# EAGLE design Group 10 Plant Sensor (EAGLE 9.2.0)
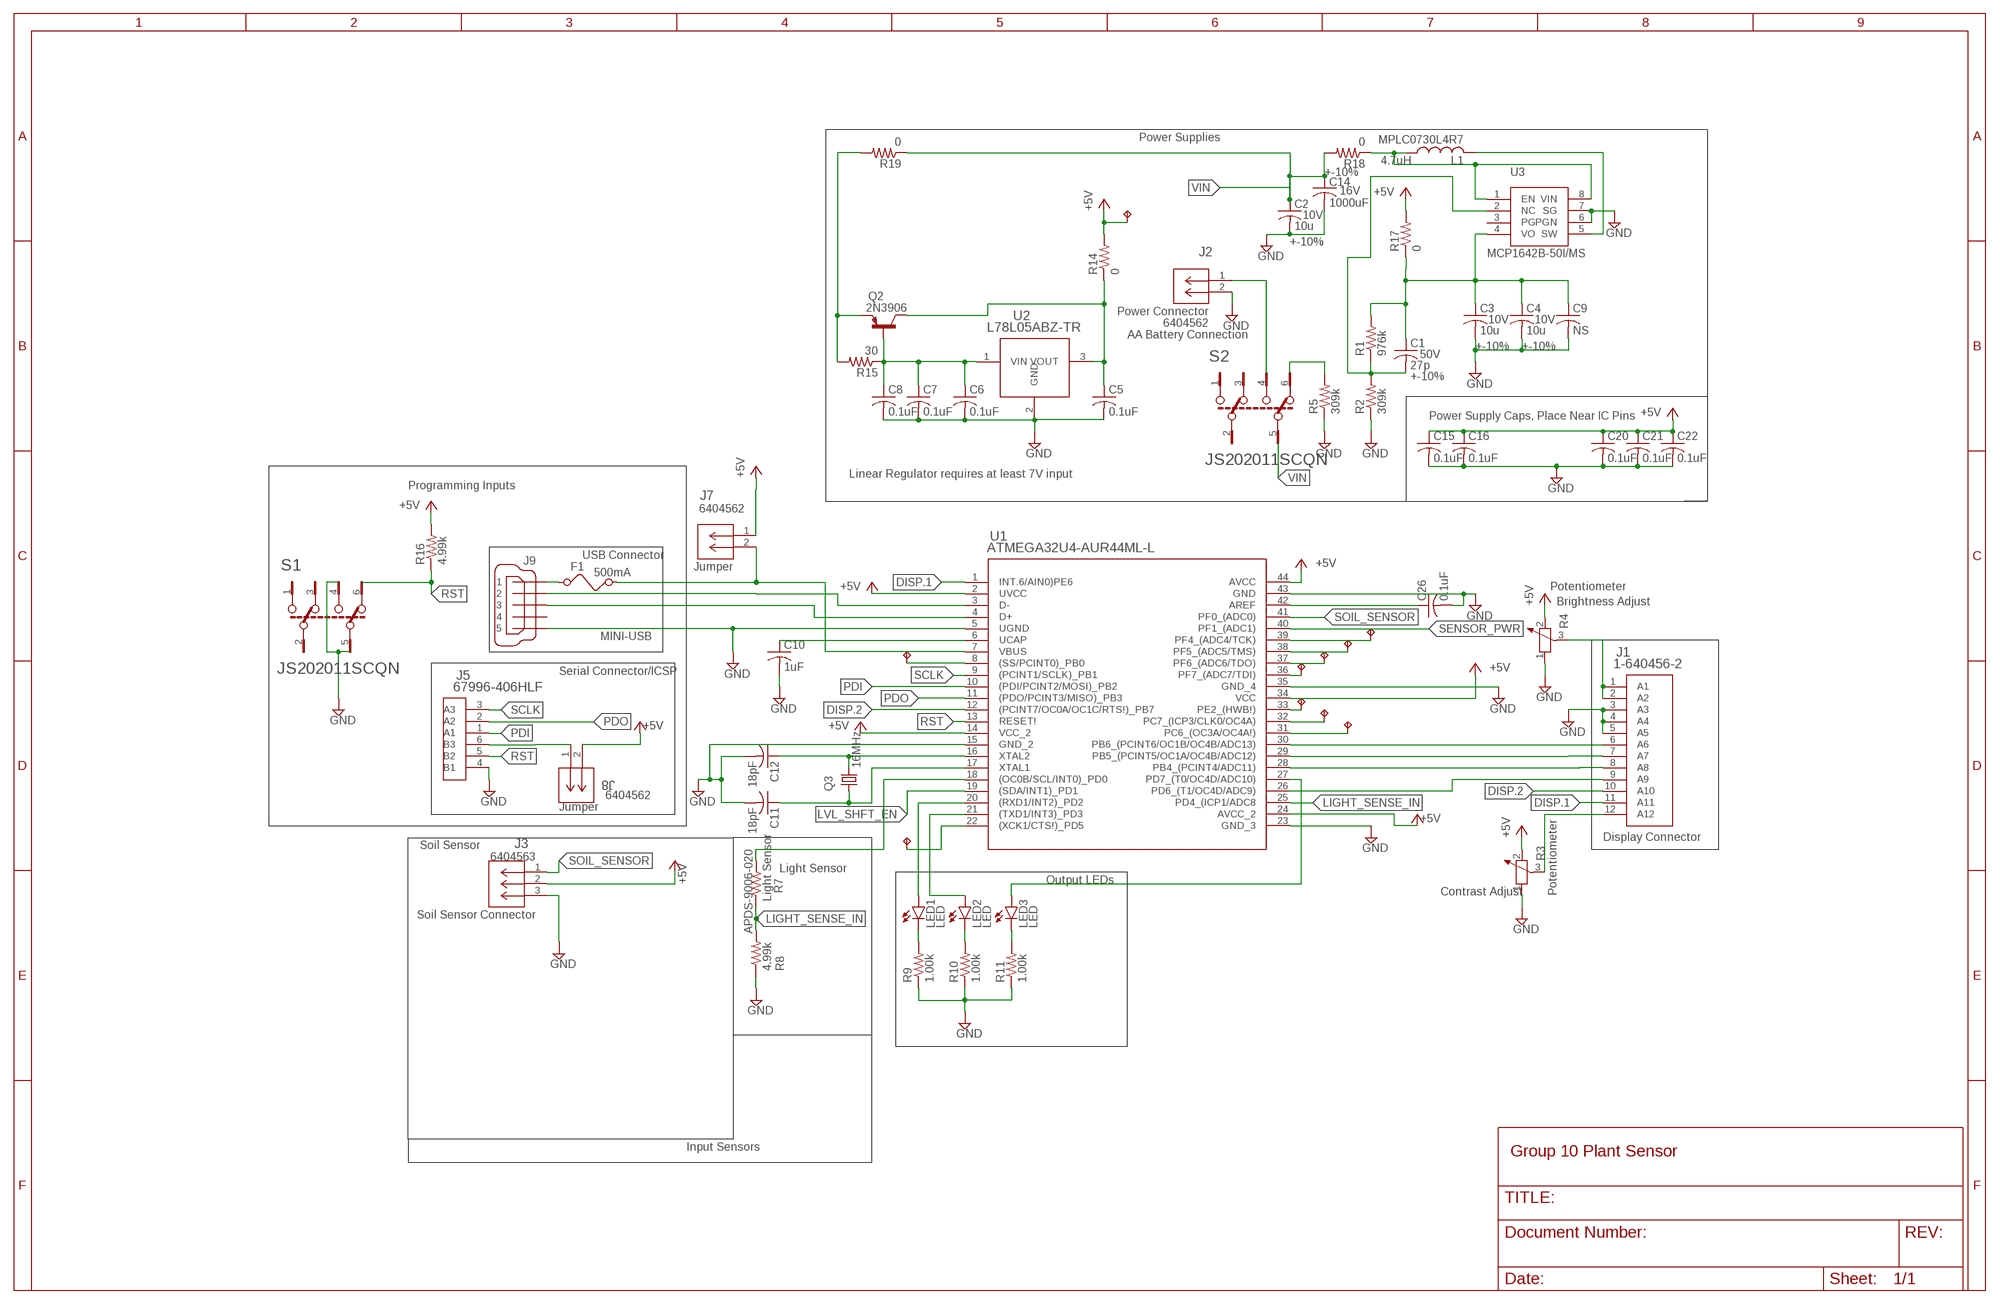
[diagram p0: schematic, sheet 1]

## Parts
C1  27p  C-USC0805K  [C0805K]
C2  10u  C-USC0805K  [C0805K]
C3  10u  C-USC0805K  [C0805K]
C4  10u  C-USC0805K  [C0805K]
C5  0.1uF  C-USC0805  [C0805]
C6  0.1uF  C-USC0805  [C0805]
C7  0.1uF  C-USC0805  [C0805]
C8  0.1uF  C-USC0805  [C0805]
C9  NS  C-USC0603K  [C0603K]
C10  1uF  C-USC0805K  [C0805K]
C11  18pF  C-USC0805K  [C0805K]
C12  18pF  C-USC0805K  [C0805K]
C14  1000uF  C-US050-050X075  [C050-050X075]
C15  0.1uF  C-USC0805  [C0805]
C16  0.1uF  C-USC0805  [C0805]
C20  0.1uF  C-USC0805  [C0805]
C21  0.1uF  C-USC0805  [C0805]
C22  0.1uF  C-USC0805  [C0805]
C26  0.1uF  C-USC0805  [C0805]
F1  500mA  FUSEFUSE1206  [R1206]
J1  1-640456-2  [1-640456-2]
J2  640456-2  [CONN2_640456-2]
J3  640456-3  [CONN3_640456-3]
J5  67996-406HLF  [67996-406HLF]
J7  640456-2  [CONN2_640456-2]
J8  640456-2  [CONN2_640456-2]
J9  MINI-USB  MINI-USB-32005-201  [32005-201]
L1  MPLC0730L4R7  [MPLC0730L4R7]
LED1  LED  LED3MM  [LED3MM]
LED2  LED  LED3MM  [LED3MM]
LED3  LED  LED3MM  [LED3MM]
Q2  2N3906  [TO92]
Q3  16MHz  CRYSTALHC18U-V  [HC18U-V]
R1  976k  R-US_R0805  [R0805]
R2  309k  R-US_R0805  [R0805]
R3  Potentiometer  POTENTIOMETER_PT-10S  [PT-10S]
R4  Potentiometer  POTENTIOMETER_PT-10S  [PT-10S]
R5  309k  R-US_R0805  [R0805]
R7  Light Sensor  R-US_R1206W  [R1206W]
R8  4.99k  R-US_R1206W  [R1206W]
R9  1.00k  R-US_R0805  [R0805]
R10  1.00k  R-US_R0805  [R0805]
R11  1.00k  R-US_R0805  [R0805]
R14  0  R-US_R0603  [R0603]
R15  30  R-US_R0805  [R0805]
R16  4.99k  R-US_R1206W  [R1206W]
R17  0  R-US_R0603  [R0603]
R18  0  R-US_R0603  [R0603]
R19  0  R-US_R0603  [R0603]
S1  SWITCH2  [C&K_JS202011CQN_0]
S2  SWITCH2  [C&K_JS202011CQN_0]
U1  ATMEGA32U4-AUR44ML-L  [44ML-L]
U2  L78L05ABZ-TR  [TO-92-TR]
U3  MCP1642B/D8-MSOP  [MSOP8]
U$3  TESTPIN  [1-640456-0(2)]
U$4  TESTPIN  [1-640456-0(2)]
U$5  TESTPIN  [1-640456-0(2)]
U$6  TESTPIN  [1-640456-0(2)]
U$7  TESTPIN  [1-640456-0(2)]
U$8  TESTPIN  [1-640456-0(2)]
U$9  TESTPIN  [1-640456-0(2)]
U$10  TESTPIN  [1-640456-0(2)]
U$11  TESTPIN  [1-640456-0(2)]
U$12  TESTPIN  [1-640456-0(2)]

## Nets
AREF: C26.1 U1.42(AREF)
DISP.1: J1.11(A11) U1.1(INT.6/AIN0)PE6)
DISP.2: J1.10(A10) U1.12((PCINT7/OC0A/OC1C/RTS!)_PB7)
DISP_5: J1.8(A8) U1.28(PB4_(PCINT4/ADC11))
GND: C2.2 C3.2 C4.2 C5.2 C6.2 C7.2 C8.2 C9.2 C10.2 C11.2 C12.2 C14.2 C15.2 C16.2 C20.2 C21.2 C22.2 C26.2 J1.3(A3) J1.4(A4) J1.5(A5) J2.2 J3.3 J5.4(B1) J9.5 R2.1 R3.1 R4.1 R5.1 R8.1 R9.1 R10.1 R11.1 S1.4 S1.5 U1.5(UGND) U1.15(GND_2) U1.23(GND_3) U1.35(GND_4) U1.43(GND) U2.2(GND) U3.6(PGN) U3.7(SG)
LIGHT_SENSE_IN: R7.1 R8.2 U1.25(PD4_(ICP1/ADC8)
LIGHT_SENSE_PWR: R7.2 U1.18((OC0B/SCL/INT0)_PD0)
LVL_SHFT_EN: U1.19((SDA/INT1)_PD1)
N$1: J1.12(A12) R3.3
N$2: L1.2 U3.5(SW)
N$3: J1.9(A9) U1.26(PD6_(T1/OC4D/ADC9))
N$5: C12.1 Q3.2 U1.16(XTAL2)
N$6: J1.6(A6) U1.30(PB6_(PCINT6/OC1B/OC4B/ADC13))
N$7: J1.7(A7) U1.29(PB5_(PCINT5/OC1A/OC4B/ADC12))
N$8: C11.1 Q3.1 U1.17(XTAL1)
N$9: J9.2 U1.3(D-)
N$10: J9.3 U1.4(D+)
N$11: F1.1 J9.1
N$12: LED3.K(C) R11.2
N$13: C1.1 C3.1 C4.1 C9.1 R1.2 R17.1 U3.4(VO)
N$14: J1.1(A1) J1.2(A2) R4.3
N$15: C6.1 C7.1 C8.1 Q2.2(B) R15.1 U2.1(VIN)
N$16: C10.1 U1.6(UCAP)
N$17: C5.1 Q2.1(C) R14.1 U2.3(VOUT)
N$18: LED2.K(C) R10.2
N$19: J5.6(B3) J8.1
N$20: LED1.K(C) R9.2
N$21: U1.8((SS/PCINT0)_PB0) U$12.1(TP)
N$22: R5.2 S2.6
N$23: LED1.A U1.20((RXD1/INT2)_PD2)
N$24: LED2.A U1.21((TXD1/INT3)_PD3)
N$25: LED3.A U1.27(PD7_(T0/OC4D/ADC10))
N$26: U1.31(PC6_(OC3A/OC4A!)) U$10.1(TP)
N$27: Q2.3(E) R15.2 R19.2
N$28: U1.32(PC7_(ICP3/CLK0/OC4A)) U$9.1(TP)
N$29: J2.1 S2.4
N$30: U1.33(PE2_(HWB!)) U$8.1(TP)
N$31: U1.36(PF7_(ADC7/TDI)) U$7.1(TP)
N$32: U1.37(PF6_(ADC6/TDO)) U$6.1(TP)
N$33: U1.22((XCK1/CTS!)_PD5) U$11.1(TP)
N$34: U1.38(PF5_(ADC5/TMS)) U$5.1(TP)
N$35: U1.39(PF4_(ADC4/TCK)) U$4.1(TP)
PDI: J5.1(A1) U1.10((PDI/PCINT2/MOSI)_PB2)
PDO: J5.2(A2) U1.11((PDO/PCINT3/MISO)_PB3)
RST: J5.5(B2) R16.1 S1.6 U1.13(RESET!)
SCLK: J5.3(A3) U1.9((PCINT1/SCLK)_PB1)
SENSOR_PWR: U1.40(PF1_(ADC1))
SOIL_SENSOR: J3.1 U1.41(PF0_(ADC0))
SWITCH: L1.1 R18.1 U3.1(EN) U3.8(VIN)
VBUS: F1.2 J7.2 U1.7(VBUS)
VCC: C15.1 C16.1 C20.1 C21.1 C22.1 J3.2 J7.1 J8.2 R3.2 R4.2 R14.2 R16.2 R17.2 U1.2(UVCC) U1.14(VCC_2) U1.24(AVCC_2) U1.34(VCC) U1.44(AVCC) U$3.1(TP) ; supply symbol labelled +5V
VFB: C1.2 R1.1 R2.2 U3.2(NC)
VIN: C2.1 C14.1 R18.2 R19.1 S2.5
Unconnected: J9.4 S1.1 S1.2 S1.3 S2.1 S2.2 S2.3 U3.3(PG)

## Notes on the sheet
- Power Supplies
- AA Battery Connection
- Power Supply Caps, Place Near IC Pins
- Linear Regulator requires at least 7V input
- Programming Inputs
- USB Connector
- Brightness Adjust
- Serial Connector/ICSP
- Display Connector
- Soil Sensor
- Light Sensor
- Output LEDs
- Contrast Adjust
- Input Sensors

## Library data of the parts
C1 = rcl:C-US: CAPACITOR, American symbol; COST: 0.16; DESCRIPTION: Ceramic FB Cap; DISTRIBUTER: Arrow; DIST_PART_NUMBER: C0805C270J1GACTU; MANUFACTURER: KEMET; MFG_PART_NUMBER: C0805C270J1GACTU; PACKAGE: 0805; PART_NUMBER: C0805C270J1GACTU; SPICEPREFIX: C; TOL: +-10%; VOLTAGE: 50V
C2-C4 = rcl:C-US: CAPACITOR, American symbol; COST: 0.27; DESCRIPTION: Ceramic Output Capacitor; DISTRIBUTER: Arrow; DIST_PART_NUMBER: GRM21BR61D106ME15L; MANUFACTURER: Murata; MFG_PART_NUMBER: GRM21BR61D106ME15L; PACKAGE: 0805; PART_NUMBER: GRM21BR61D106ME15L; SPICEPREFIX: C; TOL: +-10%; VOLTAGE: 10V
C5-C8 C15 C16 C20-C22 C26 = rcl:C-US: CAPACITOR, American symbol; COST: 0.35; DESCRIPTION: Power Supply Caps; DISTRIBUTER: Arrow; DIST_PART_NUMBER: C0805C104K6RACTU; MANUFACTURER: KEMET; MFG_PART_NUMBER: C0805C104K6RACTU; PACKAGE: 0805; PART_NUMBER: C0805C104K6RACTU; SPICEPREFIX: C
C9 = rcl:C-US: CAPACITOR, American symbol; SPICEPREFIX: C
C10 = rcl:C-US: CAPACITOR, American symbol; COST: 0.2; DESCRIPTION: Bypass Capacitor; DISTRIBUTER: Arrow; DIST_PART_NUMBER: LMK212BJ105KD-T; MANUFACTURER: Taiyo Yuden; MFG_PART_NUMBER: LMK212BJ105KD-T; PACKAGE: 0805; PART_NUMBER: LMK212BJ105KD-T; SPICEPREFIX: C
C11 C12 = rcl:C-US: CAPACITOR, American symbol; COST: 0.31; DESCRIPTION: Crystal Capacitor; DISTRIBUTER: Arrow; DIST_PART_NUMBER: GRM21A5C2E180JW01D; MANUFACTURER: Murata; MFG_PART_NUMBER: GRM21A5C2E180JW01D; PACKAGE: 0805; PART_NUMBER: GRM21A5C2E180JW01D; SPICEPREFIX: C
C14 = rcl:C-US: CAPACITOR, American symbol; COST: 0.36; DESCRIPTION: Input Cap; DISTRIBUTER: Arrow; DIST_PART_NUMBER: EEU-FS1A102B; MANUFACTURER: Panasonic; MFG_PART_NUMBER: EEU-FS1A102B; PACKAGE: Radial; PART_NUMBER: EEU-FS1A102B; SPICEPREFIX: C; TOL: +-10%; VOLTAGE: 16V
F1 = ECE411:FUSE; COST: 0.82; DESCRIPTION: 500mA Fuse; DISTRIBUTER: Arrow; DIST_PART_NUMBER: CC12H500MA-TR; MANUFACTURER: Eaton; MFG_PART_NUMBER: CC12H500MA-TR; PACKAGE: 1206; PART_NUMBER: CC12H500MA-TR
J1 = ECE411:1-640456-2; COST: 0.47; DESCRIPTION: 12-Pin Headder; DISTRIBUTER: Arrow; DIST_PART_NUMBER: 1-640456-2; MANUFACTURER: TE; MANUFACTURER_PART_NUMBER: 16404562; MFG_PART_NUMBER: 1-640456-2; PACKAGE: 2.54mm; VENDOR: TE Connectivity
J2 = ECE411:640456-2; COMMENT: Power Connector; COST: 0.1; DESCRIPTION: 2 Pin Header; DISTRIBUTER: Arrow; DIST_PART_NUMBER: 640456-2; MANUFACTURER: TE; MANUFACTURER_PART_NUMBER: 6404562; MFG_PART_NUMBER: 640456-2; PACKAGE: HDR 2 POS 2.54mm; PART_NUMBER: 640456-2; VENDOR: TE Connectivity
J3 = ECE411:640456-3; COST: 0.11; DESCRIPTION: Soil Sensor Connector; DISTRIBUTER: Arrow; DIST_PART_NUMBER: 640456-3; MANUFACTURER: TE-Connectivity; MANUFACTURER_PART_NUMBER: 6404563; MFG_PART_NUMBER: 640456-3; NOTE: Soil Sensor Connector; PACKAGE: HDR 3 POS 2.54mm; PART_NUMBER: 640456-3; VENDOR: TE Connectivity
J5 = ECE411:67996-406HLF; COST: 0.3; DESCRIPTION: Serial Connector; DISTRIBUTER: Arrow; DIST_PART_NUMBER: 67996-406HLF; MANUFACTURER: Amphenol; MANUFACTURER_PART_NUMBER: 67996406HLF; MFG_PART_NUMBER: 67996-406HLF; PACKAGE: HDR 6 POS 2.54mm; PART_NUMBER: 67996-406HLF; VENDOR: Amphenol FCI
J7 = ECE411:640456-2; COMMENT: Jumper; COST: 0.1; DESCRIPTION: Jumper; DISTRIBUTER: Arrow; DIST_PART_NUMBER: 640456-2; MANUFACTURER: TE; MANUFACTURER_PART_NUMBER: 6404562; MFG_PART_NUMBER: 640456-2; PACKAGE: HDR 2 POS 2.54mm; PART_NUMBER: 640456-2; VENDOR: TE Connectivity
J8 = ECE411:640456-2; COMMENT: Jumper; COST: 0.1; DESCRIPTION: 2 Pin Header; DISTRIBUTER: Arrow; DIST_PART_NUMBER: 640456-2; MANUFACTURER: TE; MANUFACTURER_PART_NUMBER: 6404562; MFG_PART_NUMBER: 640456-2; PACKAGE: HDR 2 POS 2.54mm; PART_NUMBER: 640456-2; VENDOR: TE Connectivity
J9 = con-cypressindustries:MINI-USB-: MINI USB-B Conector Source: www.cypressindustries.com; COST: 0.67; DESCRIPTION: USB Connector; DISTRIBUTER: Arrow; DIST_PART_NUMBER: UJ2-MABH-2-SMT-TR; MANUFACTURER: CUI Inc; MFG_PART_NUMBER: UJ2-MABH-2-SMT-TR; OC_FARNELL: unknown; OC_NEWARK: unknown; PACKAGE: 5 POS 0.8mm Solder; PART_NUMBER: UJ2-MABH-2-SMT-TR
L1 = ECE411:MPLC0730L4R7; COST: 1.11; DESCRIPTION: Boost Inductor; DISTRIBUTER: Arrow; DIST_PART_NUMBER: NPIM74C4R7MTRF; MANUFACTURER: NIC Componenets; MFG_PART_NUMBER: NPIM74C4R7MTRF; PACKAGE: Shielded; PART_NUMBER: NPIM74C4R7MTRF; VALUES: 4.7uH
LED1-LED3 = led:LED: LED OSRAM: - CHIPLED LG R971, LG N971, LY N971, LG Q971, LY Q971, LO R971, LY R971 LH N974, LH R974 LS Q976, LO Q976, LY Q976 LO Q996 - Hyper CHIPLED LW Q18S LB Q993, LB Q99A, LB R99A - SideLED LS A670, LO A670, LY A670, LG A670, LP A670 LB A673, LV A673, LT A673, LW A673 LH A674 LY A675 LS A676, LA A676, LO A676, LY A676, LW A676 LS A679, LY A679, LG A679 - Hyper Micro SIDELED® LS Y876, LA Y876, LO Y876, LY Y876 LT Y87S - SmartLED LW L88C, LW L88S LB L89C, LB L89S, LG L890 LS L89K, LO L89K, LY L89K LS L896, LA L896, LO L896, LY L896 - TOPLED LS T670, LO T670, LY T670, LG T670, LP T670 LSG T670, LSP T670, LSY T670, LOP T670, LYG T670 LG T671, LOG T671, LSG T671 LB T673, LV T673, LT T673, LW T673 LH T674 LS T676, LA T676, LO T676, LY T676, LB T676, LH T676, LSB T676, LW T676 LB T67C, LV T67C, LT T67C, LS T67K, LO T67K, LY T67K, LW E67C LS E67B, LA E67B, LO E67B, LY E67B, LB E67C, LV E67C, LT E67C LW T67C LS T679, LY T679, LG T679 LS T770, LO T770, LY T770, LG T770, LP T770 LB T773, LV T773, LT T773, LW T773 LH T774 LS E675, LA E675, LY E675, LS T675 LS T776, LA T776, LO T776, LY T776, LB T776 LHGB T686 LT T68C, LB T68C - Hyper Mini TOPLED® LB M676 - Mini TOPLED Santana® LG M470 LS M47K, LO M47K, LY M47K Source: http://www.osram.convergy.de LUXEON: - LUMILED® LXK2-PW12-R00, LXK2-PW12-S00, LXK2-PW14-U00, LXK2-PW14-V00 LXK2-PM12-R00, LXK2-PM12-S00, LXK2-PM14-U00 LXK2-PE12-Q00, LXK2-PE12-R00, LXK2-PE12-S00, LXK2-PE14-T00, LXK2-PE14-U00 LXK2-PB12-K00, LXK2-PB12-L00, LXK2-PB12-M00, LXK2-PB14-N00, LXK2-PB14-P00, LXK2-PB14-Q00 LXK2-PR12-L00, LXK2-PR12-M00, LXK2-PR14-Q00, LXK2-PR14-R00 LXK2-PD12-Q00, LXK2-PD12-R00, LXK2-PD12-S00 LXK2-PH12-R00, LXK2-PH12-S00 LXK2-PL12-P00, LXK2-PL12-Q00, LXK2-PL12-R00 Source: www.luxeon.com KINGBRIGHT: KA-3528ASYC Source: www.kingbright.com; COST: 0.33; DESCRIPTION: LED Indicator; DISTRIBUTER: Arrow; DIST_PART_NUMBER: WP7113SRD/J4; MANUFACTURER: Kingbright; MFG_PART_NUMBER: WP7113SRD/J4; PACKAGE: 2-Pin T-1 3/4; PART_NUMBER: WP7113SRD/J4
Q2 = transistor-pnp:2N3906: PNP Transistor; COST: 0.22; DESCRIPTION: pnp; DISTRIBUTER: Arrow; DIST_PART_NUMBER: 2N3906TAR; MANUFACTURER: ON Semiconductor; MFG_PART_NUMBER: 2N3906; PACKAGE: TO-92
Q3 = crystal:CRYSTAL: CRYSTAL; COST: 0.28; DESCRIPTION: 16MHz Crystal; DISTRIBUTER: Arrow; DIST_PART_NUMBER: FC4STCBAF16.0-BAG200; MANUFACTURER: Fox Electronics; MFG_PART_NUMBER: FC4STCBAF16.0-BAG200; OC_FARNELL: unknown; OC_NEWARK: unknown; PACKAGE: Thru-Hole Crystal
R1 = rcl:R-US_: RESISTOR, American symbol; COST: 0.32; DESCRIPTION: Feedback Resistor 1; DISTRIBUTER: Arrow; DIST_PART_NUMBER: ERA-6AEB9763V; MANUFACTURER: Panasonic; MFG_PART_NUMBER: ERA-6AEB9763V; PACKAGE: 0805; PART_NUMBER: ERA-6AEB9763V; SPICEPREFIX: R
R2 R5 R15 = rcl:R-US_: RESISTOR, American symbol; COST: 0.32; DESCRIPTION: Feedback Resistor 2; DISTRIBUTER: Arrow; DIST_PART_NUMBER: ERA-6AEB3093V; MANUFACTURER: Panasonic; MFG_PART_NUMBER: ERA-6AEB3093V; PACKAGE: 0805; PART_NUMBER: ERA-6AEB3093V; SPICEPREFIX: R
R3 R4 = rcl:POTENTIOMETER_: Potentiometer; COST: 0.31; DESCRIPTION: Trimmer; DISTRIBUTER: Arrow; DIST_PART_NUMBER: PT10LH01-102A2020; MANUFACTURER: Piher Sensors & Controls SA; MFG_PART_NUMBER: PT10LH01-102A2020; PACKAGE: T10; SPICEMODEL: POT; SPICEPREFIX: X
R7 = rcl:R-US_: RESISTOR, American symbol; COST: 1.66; DESCRIPTION: Light Sensor; DISTRIBUTER: Digi-key; DIST_PART_NUMBER: 516-1718-1-ND; MANUFACTURER: Broadcom Limited; MFG_PART_NUMBER: APDS-9006-020; PACKAGE: 1206; PARTNUMBER: APDS-9006-020; PART_NUMBER: APDS-9006-020; SPICEPREFIX: R
R8 R16 = rcl:R-US_: RESISTOR, American symbol; COST: 0.52; DESCRIPTION: Light Sensor Resistor; DISTRIBUTER: Arrow; DIST_PART_NUMBER: ERJ-PB6B4991V; MANUFACTURER: Panasonic; MFG_PART_NUMBER: ERJ-PB6B4991V; PACKAGE: 0805; PART_NUMBER: ERJ-PB6B4991V; SPICEPREFIX: R
R9-R11 = rcl:R-US_: RESISTOR, American symbol; COST: 0.09; DESCRIPTION: RC Filter Resistance; DISTRIBUTER: Arrow; DIST_PART_NUMBER: CRGH0805J1K0; MANUFACTURER: TE Connectivity; MFG_PART_NUMBER: CRGH0805J1K0; PACKAGE: 0805; PART_NUMBER: CRGH0805J1K0; SPICEPREFIX: R
R14 R17-R19 = rcl:R-US_: RESISTOR, American symbol; COST: 0.09; DESCRIPTION: 0 Ohm Jumpers; DISTRIBUTER: Arrow; DIST_PART_NUMBER: CRCW08050000Z0EBC; MANUFACTURER: Vishay; MFG_PART_NUMBER: CRCW08050000Z0EBC; PACKAGE: 0805; PART_NUMBER: CRCW08050000Z0EBC; SPICEPREFIX: R
S1 S2 = ECE411:SWITCH2; COST: 0.43; DESCRIPTION: Switch; DISTRIBUTER: Arrow; DIST_PART_NUMBER: JS202011SCQN; MANUFACTURER: C&K; MFG_PART_NUMBER: JS202011SCQN; PACKAGE: Gull Wing
U1 = ECE411:ATMEGA32U4-AUR; COST: 4.05; DESCRIPTION: uController; DISTRIBUTER: Arrow; DIST_PART_NUMBER: ATMEGA32U4-AUR; MANUFACTURER: Microchip; MANUFACTURER_PART_NUMBER: ATMEGA32U4AUR; MFG_PART_NUMBER: ATMEGA32U4-AUR; PACKAGE: 44-TQFP; VENDOR: Atmel
U2 = ECE411:L78L05ABZ-TR; COST: 0.34; DESCRIPTION: 5V Linear Regulator; DISTRIBUTER: Arrow; DIST_PART_NUMBER: L78L05ABZ-TR; MANUFACTURER: ST; MANUFACTURER_PART_NUMBER: L78L05ABZTR; MFG_PART_NUMBER: L78L05ABZ; PACKAGE: TO-92; VENDOR: STMicroelectronics
U3 = ECE411:MCP1642B/D; COST: 0.91; DESCRIPTION: 5V Power Converter; DISTRIBUTER: Arrow; DIST_PART_NUMBER: MCP1642B-50I/MS; MANUFACTURER: Microchip; MFG_PART_NUMBER: MCP1642B-50I/MS; PACKAGE: 8-Pin MSOP; PART_NUMBER: MCP1642B-50I/MS
U$3-U$12 = ECE411:TESTPIN

## Board
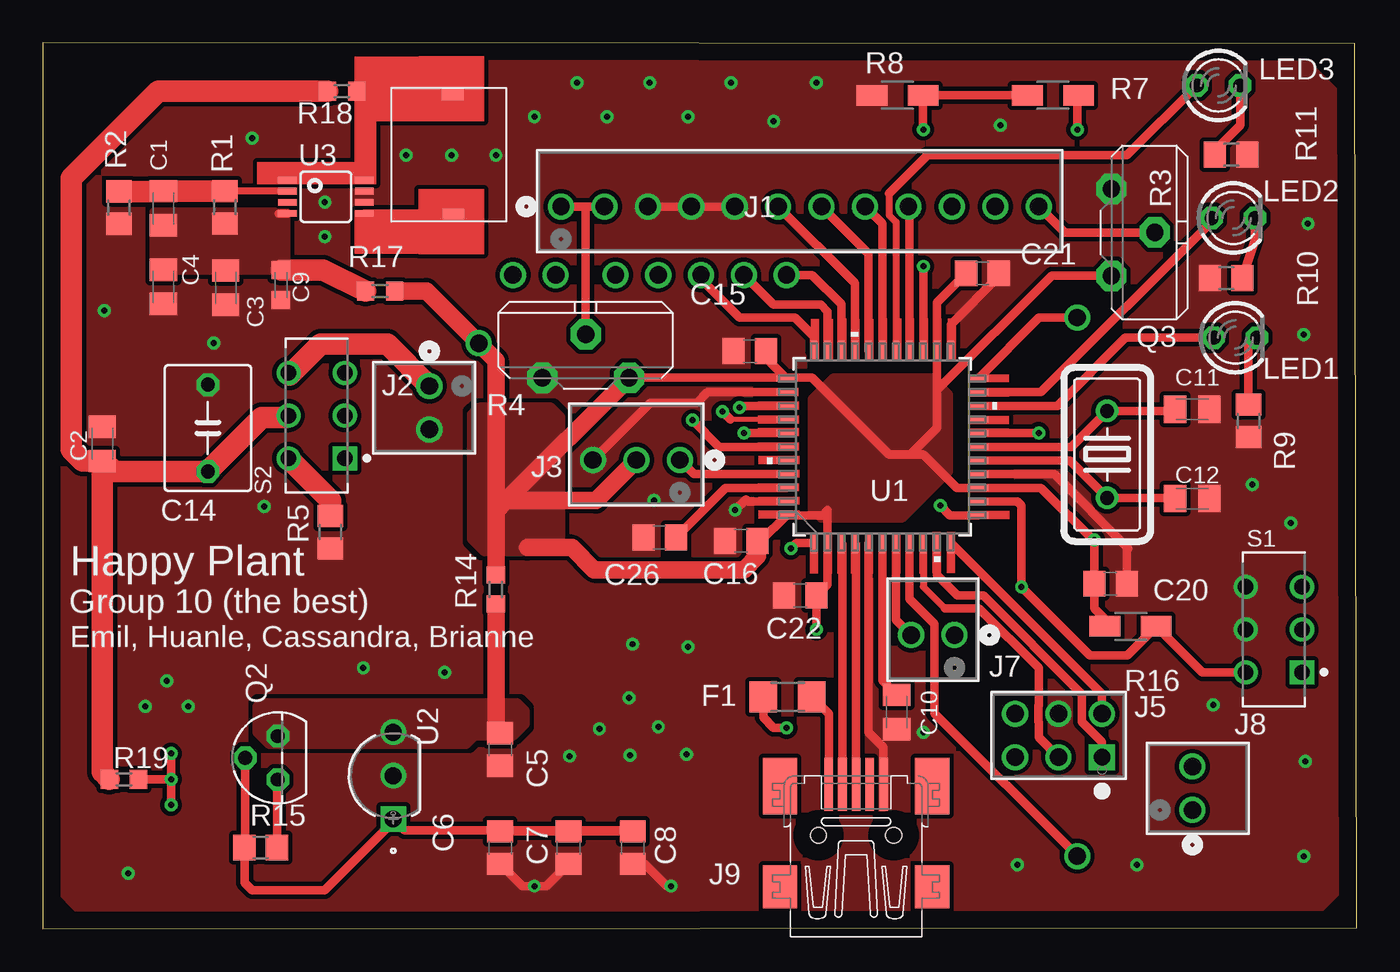
[diagram p1: board, top side]
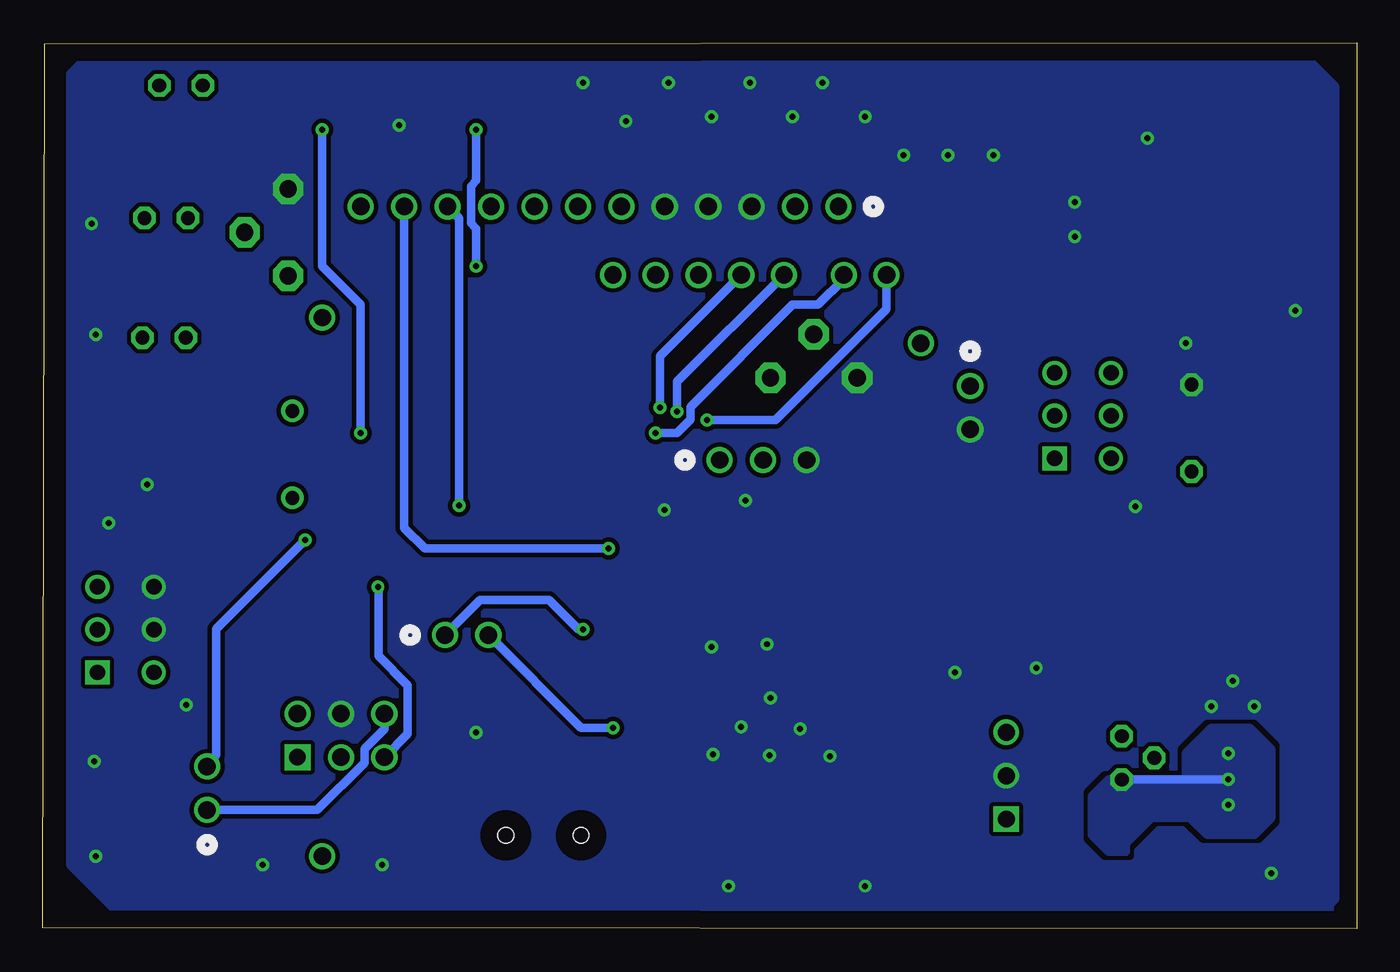
[diagram p2: board, bottom side, seen from below]

Size 76.85 x 51.83 mm. Coordinates in mm from the lower left corner, seen from the top.
Outline: 0,0 76.85,0.05 76.74,51.78 0,51.83 0,0
Copper layers (1*16): Top 0.035mm / dielectric 1.5mm / Bottom 0.035mm
Design rules "default": minimum track width 6mil, minimum drill 0.35mm, track to track 6mil, track to pad 6mil, pad to pad 6mil, via to via 6mil, smd to smd 6mil, copper to edge 40mil, drill to drill 6mil, minimum pad ring 10mil, minimum via ring 8mil, stop-mask expansion 4mil, vias tented up to drill 0mil, thermal gap 10mil

### Footprints (pad centres in the part's own frame; a part is rotated, then mirrored left to right if it is on the bottom)
C0805K = smd 1.3 x 1.6: 1 -1,0; 2 1,0
C0805 = smd 1.3 x 1.5: 1 -0.95,0; 2 0.95,0
C0603K = smd 1.05 x 1.08: 1 -0.875,0; 2 0.875,0
C050-050X075 = drill 0.813 octagon: 1 -2.54,0; 2 2.54,0
R1206 = smd 1.6 x 1.803: 1 -1.422,0; 2 1.422,0
1-640456-2 = drill 1.016 pad 1.524: 1 -27.94,0; 2 -25.4,0; 3 -22.86,0; 4 -20.32,0; 5 -17.78,0; 6 -15.24,0; 7 -12.7,0; 8 -10.16,0; 9 -7.62,0; 10 -5.08,0; 11 -2.54,0; 12 0,0
CONN2_640456-2 = drill 1.016 pad 1.524: 1 2.54,0; 2 0,0
CONN3_640456-3 = drill 1.016 pad 1.524: 1 5.08,0; 2 2.54,0; 3 0,0
67996-406HLF = drill 0.965 pad 1.524 square: 1 -5.08,2.54 | drill 1.016 pad 1.524: 2 -5.08,0; 3 -2.54,2.54; 4 -2.54,0; 5 0,2.54; 6 0,0
32005-201 = smd 3.1 x 0.5: 1 3,1.6; 2 3,0.8; 3 3,0; 4 3,-0.8; 5 3,-1.6 | smd 2.5 x 2: M1 -3,-4.45; M2 -3,4.45 | smd 3.3 x 2: M3 2.9,4.45; M4 2.9,-4.45 | hole 0.9: 0,2.2; 0,-2.2
MPLC0730L4R7 = smd 0.635 x 1.27: 1 0.4,3.6; 2 7.398,3.625
LED3MM = drill 0.813 octagon: A -1.27,0; K 1.27,0
TO92 = drill 0.813 octagon: 1 1.27,0; 2 0,1.905; 3 -1.27,0
HC18U-V = drill 0.813: 1 -2.54,0; 2 2.54,0
R0805 = smd 1.3 x 1.5: 1 -0.95,0; 2 0.95,0
PT-10S = drill 1.016 pad 1.778 octagon: 1 -2.54,-1.27; 2 2.54,-1.27; 3 0,1.27
R1206W = smd 1.8 x 1.2: 1 -1.499,0; 2 1.499,0
R0603 = smd 1 x 1.1: 1 -0.85,0; 2 0.85,0
C&K_JS202011CQN_0 = drill 0.9 pad 1.4 square: 1 -2.5,-1.65 | drill 0.9 pad 1.4: 2 0,-1.65; 3 2.5,-1.65; 4 2.5,1.65; 5 0,1.65; 6 -2.5,1.65
44ML-L = smd 1.168 x 0.356: 1 -5.613,4; 2 -5.613,3.2; 3 -5.613,2.4; 4 -5.613,1.6; 5 -5.613,0.8; 6 -5.613,0; 7 -5.613,-0.8; 8 -5.613,-1.6; 9 -5.613,-2.4; 10 -5.613,-3.2; 11 -5.613,-4; 23 5.613,-4; 24 5.613,-3.2; 25 5.613,-2.4; 26 5.613,-1.6; 27 5.613,-0.8; 28 5.613,0; 29 5.613,0.8; 30 5.613,1.6; 31 5.613,2.4; 32 5.613,3.2; 33 5.613,4 | smd 0.356 x 1.168: 12 -4,-5.613; 13 -3.2,-5.613; 14 -2.4,-5.613; 15 -1.6,-5.613; 16 -0.8,-5.613; 17 0,-5.613; 18 0.8,-5.613; 19 1.6,-5.613; 20 2.4,-5.613; 21 3.2,-5.613; 22 4,-5.613; 34 4,5.613; 35 3.2,5.613; 36 2.4,5.613; 37 1.6,5.613; 38 0.8,5.613; 39 0,5.613; 40 -0.8,5.613; 41 -1.6,5.613; 42 -2.4,5.613; 43 -3.2,5.613; 44 -4,5.613
TO-92-TR = drill 0.991 pad 1.499 square: 1 -5.08,0 | drill 0.991 pad 1.499: 2 -2.54,0; 3 0,0
MSOP8 = smd 0.4 x 1.1: 1 -0.975,-2.25; 2 -0.325,-2.25; 3 0.325,-2.25; 4 0.975,-2.25; 5 0.975,2.25; 6 0.325,2.25; 7 -0.325,2.25; 8 -0.975,2.25
1-640456-0(2) = drill 1.016 pad 1.524: 1 0,0

### Placement (x,y rotation side)
C1  7.06,42.15 90 top
C2  3.48,28.37 90 top
C3  10.7,37.5 270 top
C4  7.06,37.55 270 top
C5  26.75,10.5 270 top
C6  26.75,4.75 270 top
C7  30.75,4.75 270 top
C8  34.5,4.75 270 top
C9  13.94,37.65 270 top
C10  49.95,12.68 270 top
C11  67.23,30.38 0 top
C12  67.23,25.17 0 top
C14  9.66,29.29 90 top
C15  41.35,33.79 180 top
C16  40.85,22.69 180 top
C20  62.45,20.18 0 top
C21  54.95,38.33 0 top
C22  44.3,19.5 180 top
C26  36.08,22.89 180 top
F1  43.56,13.57 180 top
J1  58.25,42.25 0 top
J2  22.61,29.21 90 top
J3  32.18,27.42 0 top
J5  56.87,12.58 180 top
J7  50.79,17.18 0 top
J8  67.24,9.49 270 top
J9  47.57,5.46 90 top
L1  20.39,49.19 270 top
LED1  69.75,34.58 0 top
LED2  69.63,41.58 0 top
LED3  68.76,49.33 0 top
Q2  13.75,10 90 top
Q3  62.25,27.75 270 top
R1  10.66,42.2 270 top
R2  4.46,42.18 90 top
R3  63.77,40.73 270 top
R4  31.75,33.5 0 top
R5  16.83,23.2 90 top
R7  59.09,48.76 0 top
R8  49.99,48.76 0 top
R9  70.52,29.71 90 top
R10  69.21,38.06 0 top
R11  69.5,45.28 180 top
R14  26.5,19.85 90 top
R15  12.75,4.75 0 top
R16  63.62,17.69 180 top
R17  19.73,37.31 0 top
R18  17.5,49 180 top
R19  4.75,8.75 0 top
S1  72,17.5 90 top
S2  16.02,30.02 90 top
U1  49.1,28.19 90 top
U2  20.5,11.5 90 top
U3  16.56,42.82 270 top
U$3  25.5,34.25 0 top
U$4  27.5,38.25 0 top
U$5  30,38.25 0 top
U$6  33.5,38.25 0 top
U$7  36,38.25 0 top
U$8  38.5,38.25 0 top
U$9  41,38.25 0 top
U$10  43.5,38.25 0 top
U$11  60.5,35.75 0 top
U$12  60.5,4.25 0 top

### Tracks (layer width: path | path; a pad name or v marks a point on that pad's centre or on a via)
AREF
  Top 0.508: U1.42 39.93,25.79 C26.1
DISP.1  (via drill 0.35)
  Top 0.508: U1.1 44.08,22.58 v43.75,22.25
  Bottom 0.508: J1.11 55.71,23.46 54.5,22.25 v43.75,22.25
DISP.2  (via drill 0.35)
  Top 0.508: U1.12 53.06,24.19 v52.5,24.75
  Bottom 0.508: v52.5,24.75 52.5,41.58 J1.10
DISP_5
  Top 0.508: U1.28 49.1,41.24 J1.8
GND  (via drill 0.35)
  Top 0.508: J1.5 J1.3 | U1.43 41.26,24.99 41.12,25.12 v40.5,24.5 | U1.23 53.1,35.35 55.9,38.15 C21.2 | U1.15 59.16,26.59 63.5,22.25 63.4,22.15 C20.2 | U1.35 38.89,31.39 38.25,30.75 35.51,30.75 J3.3 | v36.75,2.5 36.5,2.5 35.2,3.8 C8.2 | C6.2 28.05,2.5 v28.75,2.5 29.45,2.5 C7.2 | U1.5 48.3,11.48 49.17,10.61 J9.5
  other vias: 18.75,15.25 6,13 8.5,13 10,34.25 16.5,40.5 21.25,45.25 16.5,42.5 23.9,45.25 26.5,45.25 34.5,16.65 35.75,25.05 12.25,46.25 12.95,24.7 30.8,10.1 34.35,10.15 37.65,10.2 37.75,16.5 51.5,11.5 57,3.75 64,3.75 73.85,9.8 68.45,13.1 74,41.25 73,23.75 70.75,26 73.75,34.75 56,47 32.55,11.7 33,47.5 45.25,49.5 37.75,47.5 40.25,49.5 31.25,49.5 28.75,47.5 73.75,4.25 5,3.25 3.6,36.15 7.25,14.5 23.5,15 34.3,13.5 36,11.8 42.75,47.25 35.5,49.5
  pour Top (isolate 0.254, rank 4, no thermals): 74,0.5 76.5,3 76.5,48 72.75,51.75 6,51.75 0.25,46 0.25,3 2.75,0.5
  pour Bottom (isolate 0.254, rank 4, no thermals): 1.25,1 72.5,1 75.25,3.75 75.25,50 74,51.25 3.25,51.25 1.25,49.25 1.25,1.75 1.75,1.25
LIGHT_SENSE_IN  (via drill 0.35)
  Top 0.508: v51.5,38.75 U1.25 | v51.5,46.75 51.49,46.76 R8.2 R7.1
  Bottom 0.508: v51.5,46.75 51.5,43.75 51.8,43.45 51.8,41.27 51.5,40.97 v51.5,38.75
LIGHT_SENSE_PWR  (via drill 0.35)
  Top 0.508: U1.18 54.72,29 v58.25,29 | v60.5,46.75 60.5,48.67 R7.2
  Bottom 0.508: v58.25,29 58.25,36.5 60.5,38.75 v60.5,46.75
N$1
  Top 0.508: R3.3 59.77,40.73 J1.12
N$2
  Top 0.508: U3.5 23.96,41.84 L1.2
N$3
  Top 0.508: U1.26 50.7,42.18 J1.9
N$5
  Top 0.508: U1.16 60.07,27.39 Q3.2 66.19,25.21 C12.1
N$6
  Top 0.508: U1.30 47.5,37.76 J1.6
N$7
  Top 0.508: U1.29 48.3,39.5 J1.7
N$8
  Top 0.508: U1.17 60.15,28.19 Q3.1 66.14,30.29 C11.1
N$9
  Top 0.508: U1.3 46.77,22.51 J9.2
N$10
  Top 0.508: U1.4 47.57,22.51 J9.3
N$11
  Top 0.508: J9.1 45.97,12.58 F1.1
N$12
  Top 0.508: LED3.K 70.03,47.01 68.55,45.53 R11.2
N$13
  Top 0.508: U3.4 13.79,41.84
  Top 1.27: C9.1 16.41,38.52 R17.1
  pour Top (no thermals): 6.5,41.75 6.5,38.5 11.25,38.5 14.25,41.5 14.25,41.75
  pour Top (no thermals): 6.75,38.5 13.75,38.5 14.25,39 14.25,41.95 6.5,41.95 6.5,38.75
N$14
  Top 0.508: J1.2 31.75,42.25 | 31.75,42.25 J1.1 | 31.75,42.25 R4.3
N$15
  Top 0.508: 20.59,6.33 U2.1 | 20.59,6.33 21.17,5.75 34.45,5.75 C8.1 C7.1 C6.1 | 20.59,6.33 16.5,2.25 12.25,2.25 11.8,2.7 R15.1 11.85,4.79 Q2.2
N$16
  Top 0.508: U1.6 49.1,14.53 C10.1
N$17
  Top 1.016: R14.1 26.5,11.7 C5.1
  pour Top (no thermals): 25.25,11.25 27.5,11.25 28.25,12 28.25,12.75 27.75,13.25 12.75,13.25 12.5,13 12.5,11.5 13.25,10.75 24.75,10.75
N$18
  Top 0.508: LED2.K 70.9,40.25 R10.2
N$19
  Bottom 0.508: J5.6 56.87,11.69 58.04,10.52 58.04,9.71 60.8,6.95 J8.1
N$20
  Top 0.508: LED1.K 70.52,34.08 70.52,33.83 R9.2
N$21
  Top 0.508: U1.8 50.7,19.3 52.16,17.84 52.16,12.6 U$12.1
N$22
  Top 1.27: S2.6 16.83,25.06 R5.2
N$23
  Top 0.508: U1.20 59.34,30.59 63.33,34.58 LED1.A
N$24
  Top 0.508: U1.21 58.39,31.39 68.36,41.36 LED2.A
N$25
  Top 0.406: U1.27 49.9,41.35 49.5,41.75 49.5,43
  Top 0.508: 49.5,43 51.75,45.25 63.41,45.25 LED3.A
N$26
  Top 0.508: U1.31 46.7,36.55 45,38.25 U$10.1
N$27  (via drill 0.35)
  Top 0.508: Q2.3 13.7,8.68 R15.2 | R19.2 v7.5,8.75 | v7.5,8.75 v7.5,10.25 | v7.5,8.75 v7.5,7.25
  Bottom 0.508: v7.5,8.75 11.25,8.75 11.27,8.73 Q2.3
  pour Bottom (isolate 0.254, no thermals): 5,6.5 5,10.5 6.25,11.75 8.5,11.75 10,10.25 10,8.75 14.5,8.75 15.5,7.75 15.5,5.5 14.5,4.5 13.5,4.5 13.5,5 12,6.5 9.75,6.5 8.75,5.5 6,5.5
N$28
  Top 0.508: U1.32 45.9,36.1 45.5,36.5 42.75,36.5 U$9.1
N$29
  Top 0.508: S2.4 14.45,32.44 14.45,32.4
  Top 1.27: J2.1 20.16,34.2 16.25,34.2 14.45,32.4
N$30
  Top 0.508: U1.33 45.1,34.65 44,35.75 40.75,35.75 38.5,38
  Top 1.016: U$8.1 38.5,38
N$31  (via drill 0.35)
  Top 0.508: U1.36 40.84,30.59 v40.75,30.5
  Bottom 0.508: v40.75,30.5 40.75,33.5 U$7.1
N$32  (via drill 0.35)
  Top 0.305: U1.37 40.21,29.79
  Top 0.508: 40.21,29.79 v39.75,30.25
  Bottom 0.508: v39.75,30.25 39.75,32 U$6.1
N$33
  Top 0.508: U1.22 58.27,35.75 U$11.1
N$34  (via drill 0.35)
  Top 0.508: U1.38 v41.01,28.99 v41,29
  Bottom 0.508: v41,29 39.75,29 38.97,29.79 38.97,30.54 33,36.5 31.5,36.5 30,38 U$5.1
N$35  (via drill 0.35)
  Top 0.508: U1.39 39.56,28.19 v38,29.75
  Bottom 0.508: v38,29.75 34,29.75 27.5,36.25 U$4.1
PDI
  Top 0.508: U1.10 52.3,20.7 53.5,19.5 55,19.5 60.78,13.72 60.78,12.1 61.95,10.93 J5.1
PDO
  Top 0.508: U1.11 61.95,13.73 J5.2
RST  (via drill 0.35)
  Top 0.508: U1.13 57.01,24.99 57.25,24.75 57.25,22 v57.25,20 61.25,16 63.43,16 R16.1 67.81,15 S1.6
  Bottom 0.508: J5.5 55.5,11.41 55.5,14.25 57.21,15.96 57.21,20 v57.25,20
SCLK
  Top 0.406: U1.9 51.5,20 52.75,18.75
  Top 0.508: 52.75,18.75 54.75,18.75 58.25,15.25 58.25,13.07 58.24,13.06 58.24,12.1 58.25,12.09 58.25,11.2 J5.3
SOIL_SENSOR
  Top 0.508: U1.41 38.09,26.59 J3.1
SWITCH
  Top 0.406: U3.8 U3.1
  Top 0.508: U3.8 18.81,48.54 R18.1 23.78,49 L1.1
VBUS  (via drill 0.35)
  Top 0.508: U1.7 49.9,18.07 J7.2 | F1.2 42.14,12.36 42.75,11.75 v43.5,11.75
  Bottom 0.508: v43.5,11.75 45.36,11.75 J7.2
VCC  (via drill 0.35)
  Top 0.508: C16.1 41.99,22.69 U1.44 45.59,24.19 45.9,24.5 U1.2 45.9,20.15 C22.1 v45.25,17.5 | U1.34 42.3,33.38 C15.1 | C21.1 52.3,36.63 U1.24 52.3,31.5 | C20.1 61.5,22.68 58.39,25.79 U1.14 53.46,25.79 51.5,27.75 50.75,27.75 | U1.34 43.55,32.25 45,32.25 49.5,27.75 50.75,27.75 | 52.3,31.5 52.3,29.3 50.75,27.75 | 52.3,31.5 59.01,38.21 62.48,38.21 R3.2 | U1.34 43.43,32.25 38,32.25 34.31,32.25 R4.2 | C20.1 61.5,18.75 62.12,18.13 R16.2 | v61.5,22.75 C20.1
  Top 1.016: 28.35,22.3 30.95,22.3 32.25,21 41,21 41.8,21.8 C16.1 | 26.5,24.44 27.11,25.05 | 27.11,25.05 34.31,32.25 | 26.5,24.44 R14.2 | R17.2 22.44,37.31 U$3.1 26.5,33.25 26.5,24.44 | J3.2 32.34,25.05 27.11,25.05
  Bottom 0.508: v61.5,22.75 66.72,17.54 66.72,10.18 67.24,9.65 J8.2 | v45.25,17.5 45.5,17.5 47.25,19.25 51.26,19.25 J7.1
  pour Top (no thermals): 45,24.5 45,31 46.25,32.25 52,32.25 53,31.25 53,26.75 50.25,24 45.5,24
  pour Top (isolate 1.016, no thermals): 26.5,23.25 26.5,22.25 26.25,22
  pour Top: 25.65,30.55 29.7,30.55 30.3,29.95 30.3,22.35 30,22.05 25.8,22.05 25.4,22.45 25.05,22.8 25.05,29.85 25.05,30.1 25.45,30.5
VFB
  Top 0.406: U3.2 10.75,43.15
  Top 0.508: R1.1 | 6.99,43.13 7,43.15 10.75,43.15 10.74,43.15
  Top 1.016: R1.1 7,43.15
  Top 1.27: 6.99,43.13 R2.2 | 10.74,43.15 C1.2
VIN
  Top 1.27: R18.2 6.75,49 1.65,43.9 1.65,28.05 2.33,27.37 C2.1 | C2.1 3.58,27.37 4.2,26.75 C14.1 12.81,29.9 14.25,29.9 S2.5 | C2.1 3.48,9.17 R19.1
(copper drawn outside any net)
  shapes: Top area x4

### Text on the board
tNames: Happy Plant | Group 10 (the best) | Emil, Huanle, Cassandra, Brianne